# Altium schematic sheet AUAV_X05_POWER.SchDoc
size A4
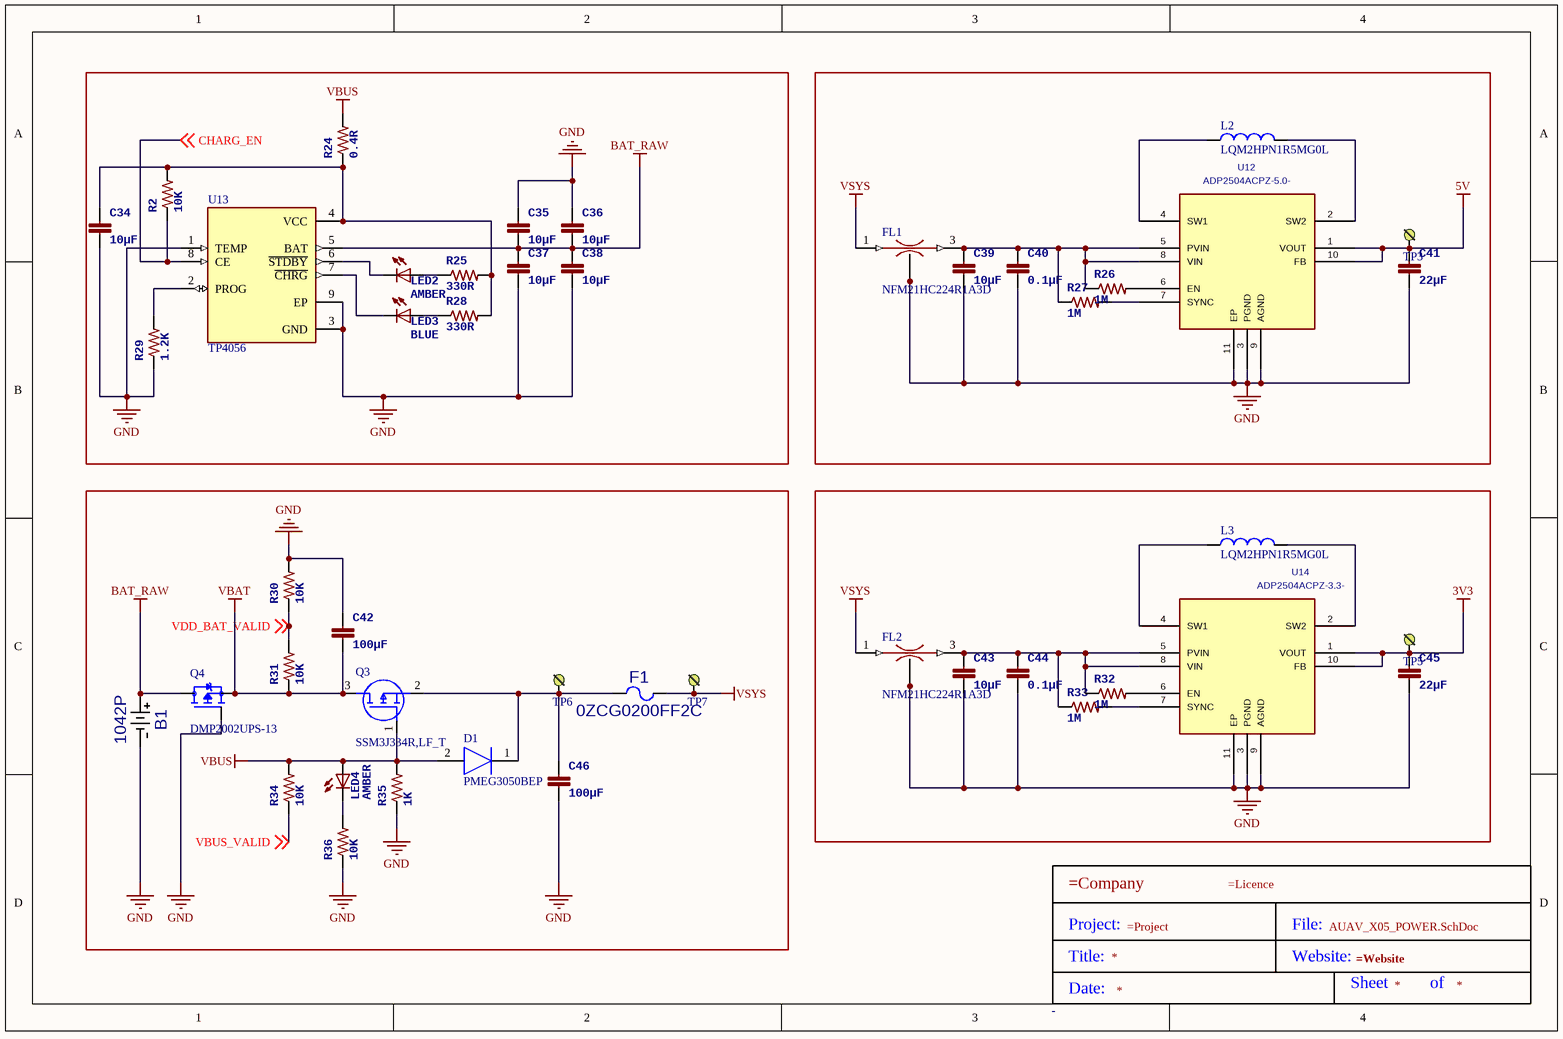
[diagram p0: AUAV_X05_POWER.SchDoc]

## Parts
*?  Title Block  (value not drawn)
B1  1042P  [1042P_KEY]
C34  10µF  [0805-CAP]
C35  10µF  [0805-CAP]
C36  10µF  [0805-CAP]
C37  10µF  [0805-CAP]
C38  10µF  [0805-CAP]
C39  10µF  [0805-CAP]
C40  0.1µF  [0402-CAP]
C41  22µF  [0805-CAP]
C42  100µF  [0805-CAP]
C43  10µF  [0805-CAP]
C44  0.1µF  [0402-CAP]
C45  22µF  [0805-CAP]
C46  100µF  [0805-CAP]
D1  PMEG3050BEP  [PMEG3050EP115]
F1  0ZCG0200FF2C  [0ZCG_BEL]
FL1  NFM21HC224R1A3D  [FIL_NFM21HC224R1A3D]
FL2  NFM21HC224R1A3D  [FIL_NFM21HC224R1A3D]
L2  LQM2HPN1R5MG0L  [INDC2520X100N]
L3  LQM2HPN1R5MG0L  [INDC2520X100N]
LED2  AMBER  [0603-LED]
LED3  BLUE  [0603-LED]
LED4  AMBER  [0603-LED]
Q3  SSM3J334R,LF_T  [SOTFL95P240X88-3N]
Q4  DMP2002UPS-13  [TRANS_DMP2002UPS-13]
R2  10K  [0402-RES]
R24  0.4R  [0402-RES]
R25  330R  [0402-RES]
R26  1M  [0402-RES]
R27  1M  [0402-RES]
R28  330R  [0402-RES]
R29  1.2K  [0402-RES]
R30  10K  [0402-RES]
R31  10K  [0402-RES]
R32  1M  [0402-RES]
R33  1M  [0402-RES]
R34  10K  [0402-RES]
R35  1K  [0402-RES]
R36  10K  [0402-RES]
TP3  TP  [SMT_PAD]  (value not drawn)
TP5  TP  [SMT_PAD]  (value not drawn)
TP6  TP  [SMT_PAD]  (value not drawn)
TP7  TP  [SMT_PAD]  (value not drawn)
U12  ADP2504ACPZ-5.0-  [CP_10_9_ADI]
U13  TP4056  [SOP127P600X175-9N]
U14  ADP2504ACPZ-3.3-  [CP_10_9_ADI]

## Nets
3V3: C45.P$1 TP5.1 U14.1(VOUT) U14.10(FB)
5V: C41.P$1 TP3.1 U12.1(VOUT) U12.10(FB)
BAT_RAW: B1.2 C35.P$2 C36.P$2 C37.P$1 C38.P$1 Q4.5_8(D) U13.5(BAT)
GND: B1.1 C34.P$2 C35.P$1 C36.P$1 C37.P$2 C38.P$2 C39.P$2 C40.P$2 C41.P$2 C42.P$1 C43.P$2 C44.P$2 C45.P$2 C46.P$2 FL1.2(GND) FL1.2_1(GND) FL1.2_2(GND) FL1.2_3(GND) FL1.2_4(GND) FL2.2(GND) FL2.2_1(GND) FL2.2_2(GND) FL2.2_3(GND) FL2.2_4(GND) Q4.4(G) R29.P$1 R30.P$2 R35.P$1 R36.P$1 U12.3(PGND) U12.9(AGND) U12.11(EP) U13.1(TEMP) U13.3(GND) U13.9(EP) U14.3(PGND) U14.9(AGND) U14.11(EP)
VBAT: C42.P$2 Q3.3(D) Q4.1(S) Q4.2(S) Q4.3(S) R31.P$1
VBUS: D1.2(A) LED4.A Q3.1(G) R24.P$2 R34.P$2 R35.P$2
VSYS: F1.2 FL1.1(IN) FL2.1(IN) TP7.1
CHARG_EN: R2.P$1 U13.8(CE) ; off-sheet CHARG_EN
VBUS_VALID: R34.P$1 ; off-sheet VBUS_VALID
VDD_BAT_VALID: R30.P$1 R31.P$2 ; off-sheet VDD_BAT_VALID
NetC34_P$1: C34.P$1 R2.P$2 R24.P$1 R25.P$2 R28.P$2 U13.4(VCC)
NetC39_P$1: C39.P$1 C40.P$1 FL1.3(OUT) R26.P$1 R27.P$1 U12.5(PVIN) U12.8(VIN)
NetC43_P$1: C43.P$1 C44.P$1 FL2.3(OUT) R32.P$1 R33.P$1 U14.5(PVIN) U14.8(VIN)
NetC46_P$1: C46.P$1 D1.1(K) F1.1 Q3.2(S) TP6.1
NetL2_1: L2.1 U12.4(SW1)
NetL2_2: L2.2 U12.2(SW2)
NetL3_1: L3.1 U14.4(SW1)
NetL3_2: L3.2 U14.2(SW2)
NetLED2_A: LED2.A R25.P$1
NetLED2_C: LED2.C U13.6(~{STDBY})
NetLED3_A: LED3.A R28.P$1
NetLED3_C: LED3.C U13.7(~{CHRG})
NetLED4_C: LED4.C R36.P$2
NetR26_P$2: R26.P$2 U12.6(EN)
NetR27_P$2: R27.P$2 U12.7(SYNC)
NetR29_P$2: R29.P$2 U13.2(PROG)
NetR32_P$2: R32.P$2 U14.6(EN)
NetR33_P$2: R33.P$2 U14.7(SYNC)

## Notes on the sheet
- (in symbol Title Block) Project:; File:; Title:; Website:; Sheet; of; Date:

## Library data of the parts
B1 = 1042P: Mfr_Name: Keystone Electronics; C: Copyright (C) 2018 Accelerated Designs. All rights reserved; Copyright: Copyright (C) 2022 Ultra Librarian. All rights reserved.; Manufacturer_Part_Number: 1042P; Value: 1042P
C34-C39 C41-C43 C45 C46 = CAP0805: CAP CER 4.7UF 16V 10% X7R 0805; PARTNO: CL21B475KOFNNNE; 3DR_PARTNO: ECM0622; Value: 4u7; DATASHEET: http://www.digikey.com/product-detail/en/CL21B475KOFNNNE/1276-2873-2-ND/3888531; Supplier 1: Digi-Key; Supplier Part Number 1: 1276-2873-1-ND
C40 C44 = CAP0402: CAP CER 8PF 50V C0G 0402; PARTNO: C1005C0G1H080C; 3DR_PARTNO: ECM0710; Value: 8p; Supplier 1: Digi-Key; Supplier Part Number 1: 445-4890-1-ND
D1 = PMEG3050BEP: Diode; Manufacturer_Name: Nexperia; Datasheet Link: https://assets.nexperia.com/documents/data-sheet/PMEG3050BEP.pdf; Height: 1mm; Manufacturer_Part_Number: PMEG3050BEP; Mouser Part Number: N/A; Mouser Price/Stock: https://www.mouser.com/Search/Refine.aspx?Keyword=N%2FA
F1 = 0ZCG0200FF2C: Mfr_Name: Belfuse; Copyright: Copyright (C) 2022 Ultra Librarian. All rights reserved.; Manufacturer_Part_Number: 0ZCG0200FF2C; Digi-Key_Part_Number_1: 507-1777-1-ND; Digi-Key_Part_Number_2: 507-1777-2-ND; Digi-Key_Part_Number_3: 507-1777-6-ND; Value: 0ZCG0200FF2C
FL1 FL2 = NFM21HC224R1A3D: SMD Capacitor with Capacitance: 0.22uF Tol. 20%. Rated Voltage: 10Vdc; MF: Murata; Digi-Key_Part_Number: 490-14852-1-ND; Package: NONSTANDARD; MP: NFM21HC224R1A3D; Value: *; SnapEDA_Link: https://www.snapeda.com/parts/NFM21HC224R1A3D/Murata/view-part/4381694/?ref=snap
L2 L3 = LQM2HPN1R5MG0L: INDUCTOR, 1.5UH, 20%, 1.5A, 50MHZ, 1008; Package: None; Price: None; Value: *; MP: LQM2HPN1R5MG0L; Availability: Unavailable
LED2 LED4 = LED0603: LED 1.6X0.8 DOME ORN CLEAR SMD; PARTNO: APTD1608SECK; 3DR_PARTNO: ECM0515; Supplier 1: Digi-Key; Value: AMBER; Supplier Part Number 1: 754-1802-1-ND
LED3 = LED0603: LED 1.6X0.8 DOME ORN CLEAR SMD; PARTNO: APTD1608SECK; 3DR_PARTNO: ECM0515; Value: AMBER; Supplier 1: Digi-Key; Supplier Part Number 1: 754-1802-1-ND
Q3 = SSM3J334R,LF_T: MOSFET (P-Channel); Manufacturer_Name: Toshiba; Manufacturer_Part_Number: SSM3J334R,LF(T; Datasheet Link: http://toshiba.semicon-storage.com/info/docget.jsp?did=5579&prodName=SSM3J334R; Height: 0.88mm; Arrow Part Number: SSM3J334R,LF(T; Arrow Price/Stock: https://www.arrow.com/en/products/ssm3j334rlf-t/toshiba
Q4 = DMP2002UPS-13: P-Channel 20V 60A (Tc) 2.3W (Ta) Surface Mount PowerDI5060-8 (Type K); MF: Diodes Inc.; Package: PowerTDFN-8 Diodes Incorporated; SnapEDA_Link: https://www.snapeda.com/parts/DMP2002UPS-13/Diodes%20Inc./view-part/761846/?ref=snap; Check_prices: https://www.snapeda.com/parts/DMP2002UPS-13/Diodes%20Inc./view-part/761846/?ref=eda; Value: *; MP: DMP2002UPS-13; Digi-Key_Part_Number: DMP2002UPS-13DICT-ND
R2 R24-R36 = RESISTOR0402-RES: RES 10K OHM 1/16W 1% 0402 SMD; PARTNO: RC0402FR-0710KL; 3DR_PARTNO: ECM0800; Supplier 1: Digi-Key; Value: 10K; Supplier Part Number 1: 311-10.0KLRCT-ND
U12 = ADP2504ACPZ-5.0-R7: Mfr_Name: Analog Devices Inc; Value: ADP2504ACPZ-5.0-; Copyright: Copyright (C) 2022 Ultra Librarian. All rights reserved.; Manufacturer_Part_Number: ADP2504ACPZ-5.0-R7
U13 = TP4056: Complete single cell Li-Ion battery with a constant current / constant voltage linear charger; MF: NanJing Top Power ASIC Corp.; Price: None; Availability: No availability data; Value: *; MP: TP4056; Check_prices: https://www.snapeda.com/parts/TP4056%20/NanJing%20Top%20Power%20ASIC%20Corp./view-part/2888426/?ref=eda; SnapEDA_Link: https://www.snapeda.com/parts/TP4056%20/NanJing%20Top%20Power%20ASIC%20Corp./view-part/2888426/?ref=snap; Package: Package
U14 = ADP2504ACPZ-3.3-R7: Mfr_Name: Analog Devices Inc; Value: ADP2504ACPZ-3.3-; Copyright: Copyright (C) 2022 Ultra Librarian. All rights reserved.; Manufacturer_Part_Number: ADP2504ACPZ-3.3-R7
*? = Title Block: Size: -